# EAGLE design BUFFER (EAGLE 9.4.2)
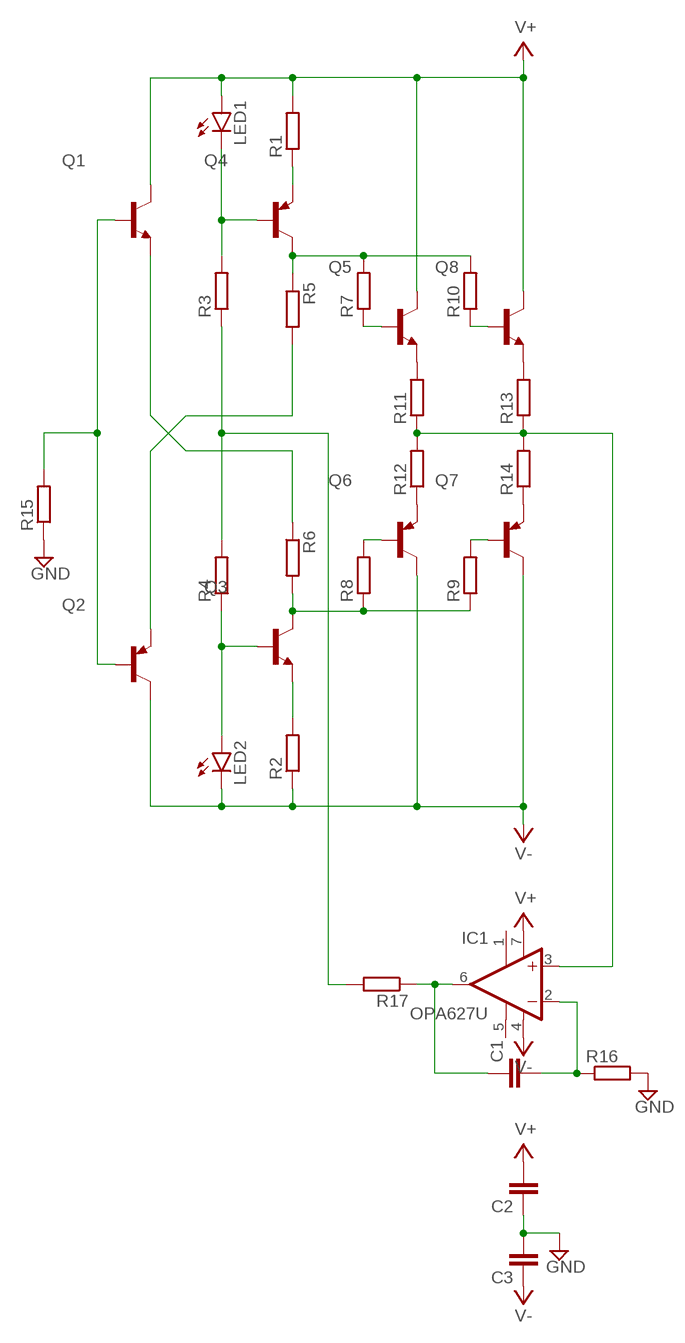
[diagram p0: schematic, sheet 1]

## Parts
C1  C-EUC0805  [C0805]
C2  C-EUC0805  [C0805]
C3  C-EUC0805  [C0805]
IC1  OPA627U  [SO08]
LED1  LEDCHIPLED_1206  [CHIPLED_1206]
LED2  LEDCHIPLED_1206  [CHIPLED_1206]
Q1  TRANSISTOR_BC846-NPN-SOT23-BEC  [TRANSISTOR_SOT23-BEC]
Q2  TRANSISTOR_BC856B-PNP-SOT23-BEC  [TRANSISTOR_SOT23-BEC]
Q3  TRANSISTOR_BC846-NPN-SOT23-BEC  [TRANSISTOR_SOT23-BEC]
Q4  TRANSISTOR_BC856B-PNP-SOT23-BEC  [TRANSISTOR_SOT23-BEC]
Q5  TRANSISTOR_BC846-NPN-SOT23-BEC  [TRANSISTOR_SOT23-BEC]
Q6  TRANSISTOR_BC856B-PNP-SOT23-BEC  [TRANSISTOR_SOT23-BEC]
Q7  TRANSISTOR_BC856B-PNP-SOT23-BEC  [TRANSISTOR_SOT23-BEC]
Q8  TRANSISTOR_BC846-NPN-SOT23-BEC  [TRANSISTOR_SOT23-BEC]
R1  R-EU_MELF0204R  [MINI_MELF-0204R]
R2  R-EU_MELF0204R  [MINI_MELF-0204R]
R3  R-EU_MELF0204R  [MINI_MELF-0204R]
R4  R-EU_MELF0204R  [MINI_MELF-0204R]
R5  R-EU_MELF0204R  [MINI_MELF-0204R]
R6  R-EU_MELF0204R  [MINI_MELF-0204R]
R7  R-EU_MELF0204R  [MINI_MELF-0204R]
R8  R-EU_MELF0204R  [MINI_MELF-0204R]
R9  R-EU_MELF0204R  [MINI_MELF-0204R]
R10  R-EU_MELF0204R  [MINI_MELF-0204R]
R11  R-EU_MELF0204R  [MINI_MELF-0204R]
R12  R-EU_MELF0204R  [MINI_MELF-0204R]
R13  R-EU_MELF0204R  [MINI_MELF-0204R]
R14  R-EU_MELF0204R  [MINI_MELF-0204R]
R15  R-EU_MELF0204R  [MINI_MELF-0204R]
R16  R-EU_MELF0204R  [MINI_MELF-0204R]
R17  R-EU_MELF0204R  [MINI_MELF-0204R]

## Nets
GND: C2.1 C3.2 R15.1 R16.2
N$1: Q1.B Q2.B R15.2
N$4: Q2.E R5.2
N$5: Q3.E R2.2
N$6: Q4.E R1.1
N$7: LED1.C Q4.B R3.2
N$8: LED2.A Q3.B R4.1
N$9: Q4.C R5.1 R7.2 R10.2
N$10: Q3.C R6.2 R8.1 R9.1
N$11: Q1.E R6.1
N$12: R3.1 R4.2 R17.2
N$13: Q5.B R7.1
N$14: Q5.E R11.2
N$15: Q7.B R9.2
N$16: Q8.B R10.1
N$17: Q6.B R8.2
N$18: Q6.E R12.1
N$19: IC1.3(+IN) R11.1 R12.2 R13.1 R14.2
N$20: Q8.E R13.2
N$21: Q7.E R14.1
N$22: C1.1 IC1.6(OUT) R17.1
N$24: C1.2 IC1.2(-IN) R16.1
V+: C2.2 IC1.7(V+) LED1.A Q1.C Q5.C Q8.C R1.2
V-: C3.1 IC1.4(V-) LED2.C Q2.C Q6.C Q7.C R2.1
Unconnected: IC1.1(TRIM1) IC1.5(TRIM2)

## Library data of the parts
C1-C3 = Vwvwbg:C-EU: CAPACITOR, European symbol
IC1 = burr-brown:OPA627: Difet(R) Operational Amplifiers Precision, High-Speed; MF: TEXAS INSTRUMENTS; MPN: OPA627AU; OC_FARNELL: 1207067; OC_NEWARK: 30C4516
LED1 LED2 = led:LED: LED OSRAM: - CHIPLED LG R971, LG N971, LY N971, LG Q971, LY Q971, LO R971, LY R971 LH N974, LH R974 LS Q976, LO Q976, LY Q976 LO Q996 - Hyper CHIPLED LW Q18S LB Q993, LB Q99A, LB R99A - SideLED LS A670, LO A670, LY A670, LG A670, LP A670 LB A673, LV A673, LT A673, LW A673 LH A674 LY A675 LS A676, LA A676, LO A676, LY A676, LW A676 LS A679, LY A679, LG A679 - Hyper Micro SIDELED® LS Y876, LA Y876, LO Y876, LY Y876 LT Y87S - SmartLED LW L88C, LW L88S LB L89C, LB L89S, LG L890 LS L89K, LO L89K, LY L89K LS L896, LA L896, LO L896, LY L896 - TOPLED LS T670, LO T670, LY T670, LG T670, LP T670 LSG T670, LSP T670, LSY T670, LOP T670, LYG T670 LG T671, LOG T671, LSG T671 LB T673, LV T673, LT T673, LW T673 LH T674 LS T676, LA T676, LO T676, LY T676, LB T676, LH T676, LSB T676, LW T676 LB T67C, LV T67C, LT T67C, LS T67K, LO T67K, LY T67K, LW E67C LS E67B, LA E67B, LO E67B, LY E67B, LB E67C, LV E67C, LT E67C LW T67C LS T679, LY T679, LG T679 LS T770, LO T770, LY T770, LG T770, LP T770 LB T773, LV T773, LT T773, LW T773 LH T774 LS E675, LA E675, LY E675, LS T675 LS T776, LA T776, LO T776, LY T776, LB T776 LHGB T686 LT T68C, LB T68C - Hyper Mini TOPLED® LB M676 - Mini TOPLED Santana® LG M470 LS M47K, LO M47K, LY M47K Source: http://www.osram.convergy.de LUXEON: - LUMILED® LXK2-PW12-R00, LXK2-PW12-S00, LXK2-PW14-U00, LXK2-PW14-V00 LXK2-PM12-R00, LXK2-PM12-S00, LXK2-PM14-U00 LXK2-PE12-Q00, LXK2-PE12-R00, LXK2-PE12-S00, LXK2-PE14-T00, LXK2-PE14-U00 LXK2-PB12-K00, LXK2-PB12-L00, LXK2-PB12-M00, LXK2-PB14-N00, LXK2-PB14-P00, LXK2-PB14-Q00 LXK2-PR12-L00, LXK2-PR12-M00, LXK2-PR14-Q00, LXK2-PR14-R00 LXK2-PD12-Q00, LXK2-PD12-R00, LXK2-PD12-S00 LXK2-PH12-R00, LXK2-PH12-S00 LXK2-PL12-P00, LXK2-PL12-Q00, LXK2-PL12-R00 Source: www.luxeon.com KINGBRIGHT: KA-3528ASYC Source: www.kingbright.com
Q1 Q3 Q5 Q8 = Vwvwbg:TRANSISTOR_*-NPN-: NPN Transistror BF959 corrected 2008.03.06
Q2 Q4 Q6 Q7 = Vwvwbg:TRANSISTOR_*-PNP-: PNP Transistror
R1-R17 = Vwvwbg:R-EU_: RESISTOR, European symbol

## Board
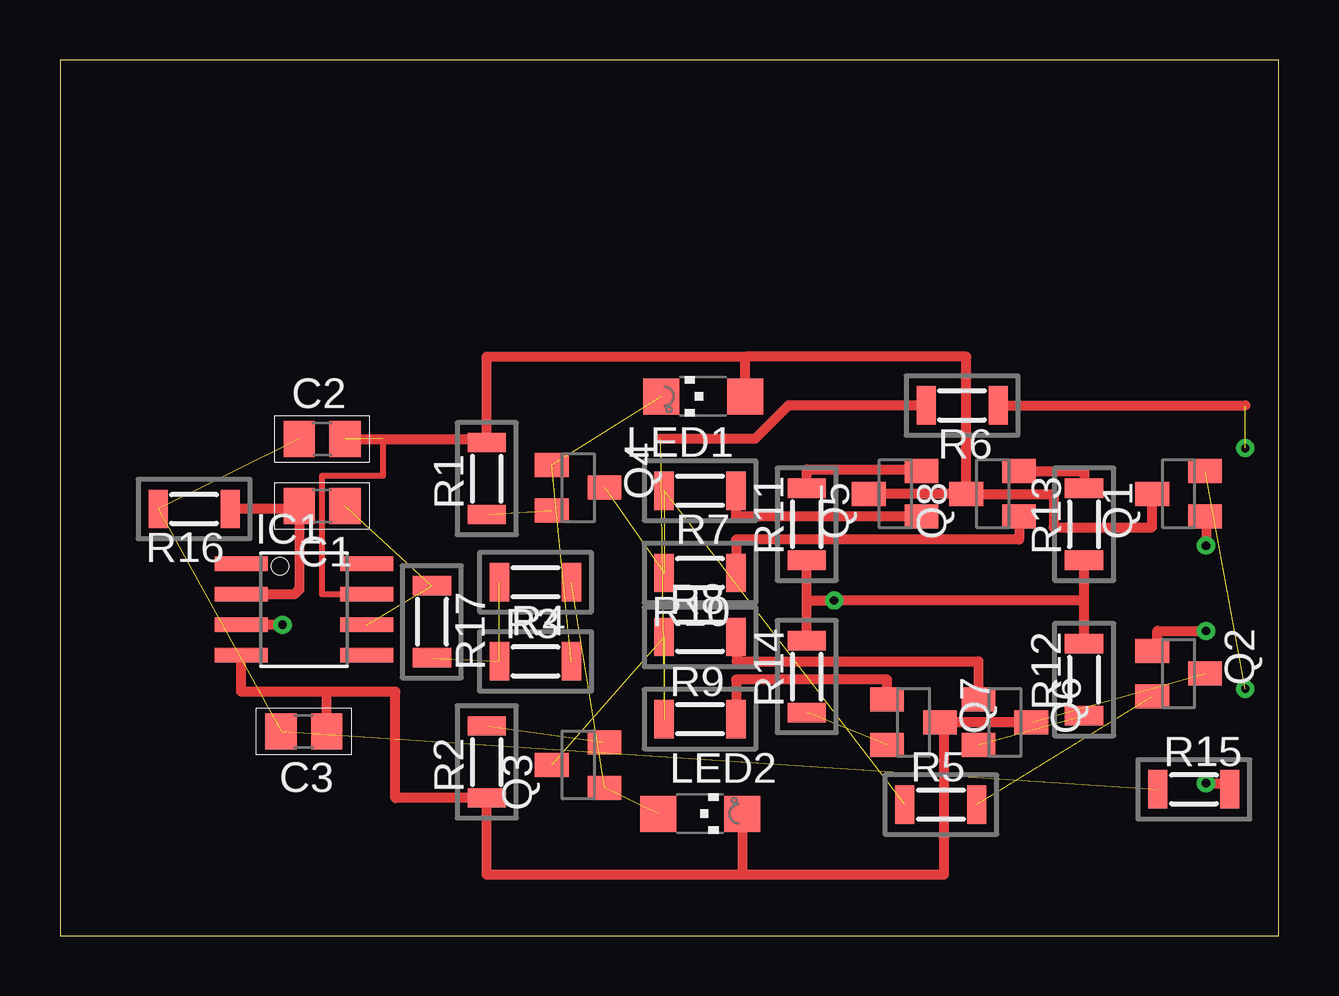
[diagram p1: board, top side]
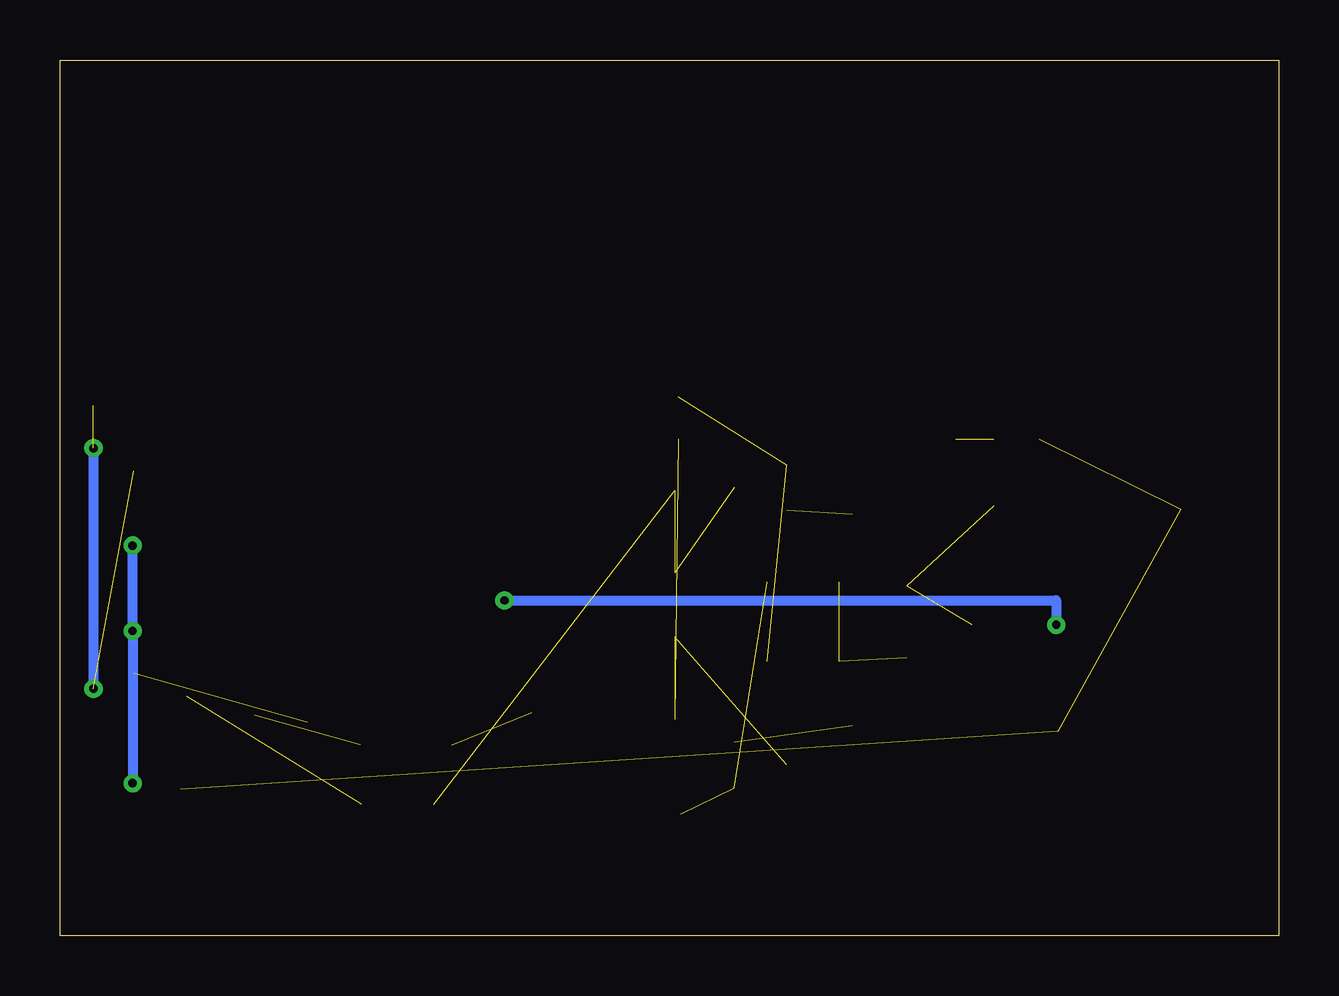
[diagram p2: board, bottom side, seen from below]

Size 50.78 x 36.5 mm. Coordinates in mm from the lower left corner, seen from the top.
Outline: 0,0 50.78,0 50.78,36.5 0,36.5 0,0
Copper layers (1*16): Top 0.035mm / dielectric 1.5mm / Bottom 0.035mm
Design rules "default": minimum track width 6mil, minimum drill 0.35mm, track to track 6mil, track to pad 6mil, pad to pad 6mil, via to via 6mil, smd to smd 6mil, copper to edge 40mil, drill to drill 6mil, minimum pad ring 10mil, minimum via ring 8mil, stop-mask expansion 4mil, vias tented up to drill 0mil, thermal gap 10mil

### Footprints (pad centres in the part's own frame; a part is rotated, then mirrored left to right if it is on the bottom)
C0805 = smd 1.3 x 1.5: 1 -0.95,0; 2 0.95,0
SO08 = smd 0.61 x 2.21: 1 -1.905,-2.616; 2 -0.635,-2.616; 3 0.635,-2.616; 4 1.905,-2.616; 5 1.905,2.616; 6 0.635,2.616; 7 -0.635,2.616; 8 -1.905,2.616
CHIPLED_1206 = smd 1.5 x 1.5: A 0,-1.75; C 0,1.75
TRANSISTOR_SOT23-BEC = smd 1 x 1.4: B -0.95,-1.1; C 0,1.1; E 0.95,-1.1
MINI_MELF-0204R = smd 0.8 x 1.6: 1 -1.5,0; 2 1.5,0

### Placement (x,y rotation side)
C1  10.92,17.91 180 top
C2  10.92,20.7 0 top
C3  10.16,8.51 180 top
IC1  10.16,13.59 270 top
LED1  26.8,22.48 90 top
LED2  26.67,5.08 270 top
Q1  46.61,18.41 90 top
Q2  46.61,10.92 270 top
Q3  21.59,7.11 90 top
Q4  21.59,18.67 270 top
Q5  34.8,18.41 90 top
Q6  39.37,8.89 270 top
Q7  35.56,8.89 270 top
Q8  38.86,18.41 90 top
R1  17.78,19.05 90 top
R2  17.78,7.24 90 top
R3  19.81,11.43 0 top
R4  19.81,14.73 180 top
R5  36.7,5.46 0 top
R6  37.59,22.1 180 top
R7  26.67,18.54 180 top
R8  26.67,12.45 0 top
R9  26.67,9.02 0 top
R10  26.67,15.11 180 top
R11  31.11,17.14 90 top
R12  42.67,10.67 90 top
R13  42.67,17.14 90 top
R14  31.11,10.79 90 top
R15  47.24,6.1 0 top
R16  5.59,17.78 180 top
R17  15.49,13.08 270 top

### Tracks (layer width: path | path; a pad name or v marks a point on that pad's centre or on a via)
GND  (3 unrouted)
N$1  (via drill 0.35)
  Top 0.406: v47.75,6.35 48.74,6.35 R15.2 | Q1.B 47.75,17.46 v47.75,16.26 | Q2.B 45.72,11.87 45.72,12.7 v47.75,12.7
  Bottom 0.406: v47.75,16.26 v47.75,12.7 v47.75,6.35
N$4  (1 unrouted)
N$5  (1 unrouted)
N$6  (1 unrouted)
N$7  (2 unrouted)
N$8  (2 unrouted)
N$9  (3 unrouted)
N$10  (3 unrouted)
  Top 0.406: R6.2 30.35,22.1 28.96,20.7 25.02,20.7
N$11  (via drill 0.35)  (2 unrouted)
  Top 0.406: R6.1 49.39,22.1
  Bottom 0.406: v49.39,20.32 v49.39,10.29
N$12  (2 unrouted)
N$13
  Top 0.406: Q5.B 28.17,17.46 R7.1
N$14
  Top 0.406: R11.2 31.11,19.43 35.83,19.43 Q5.E
N$15
  Top 0.406: Q7.B 34.46,10.67 28.17,10.67 R9.2
N$16
  Top 0.406: Q8.B 39.96,16.51 28.17,16.51 R10.1
N$17
  Top 0.406: R8.2 28.19,12.45 28.19,11.43 38.27,11.43 Q6.B
N$18  (1 unrouted)
N$19  (via drill 0.35)
  Top 0.406: R14.2 31.11,13.97 | 31.11,13.97 R11.1 | R12.2 42.67,13.97 | 42.67,13.97 R13.1 | 31.11,13.97 v32.26,13.97 42.67,13.97 | v9.27,12.95 IC1.3
  Bottom 0.406: v32.26,13.97 9.27,13.97 v9.27,12.95
N$20
  Top 0.406: Q8.E 42.67,19.36 R13.2
N$21  (1 unrouted)
N$22  (2 unrouted)
N$24
  Top 0.406: IC1.2 9.78,14.22 9.97,14.42 C1.2 9.85,17.78 R16.1
V+  (1 unrouted)
  Top 0.254: IC1.7 10.92,14.22 10.92,19.18 13.46,19.18 13.46,20.7
  Top 0.406: C2.2 17.63,20.7 R1.2 17.78,24.13 28.57,24.13 | LED1.A 28.55,24.1 28.57,24.13 | Q8.C Q5.C | Q8.C 37.76,24.13 28.57,24.13 | Q8.C 41.4,18.41 41.4,17.02 45.51,17.02 Q1.C
V-  (1 unrouted)
  Top 0.406: Q6.C Q7.C 36.83,8.89 36.83,2.54 28.42,2.54 | 28.42,2.54 17.78,2.54 R2.1 13.97,5.74 13.97,10.16 11.11,10.16 | LED2.C 28.42,2.54 | IC1.4 7.54,10.16 11.11,10.16 | C3.1 11.11,10.16